# EAGLE design Open-GCI (EAGLE 9.4.2)
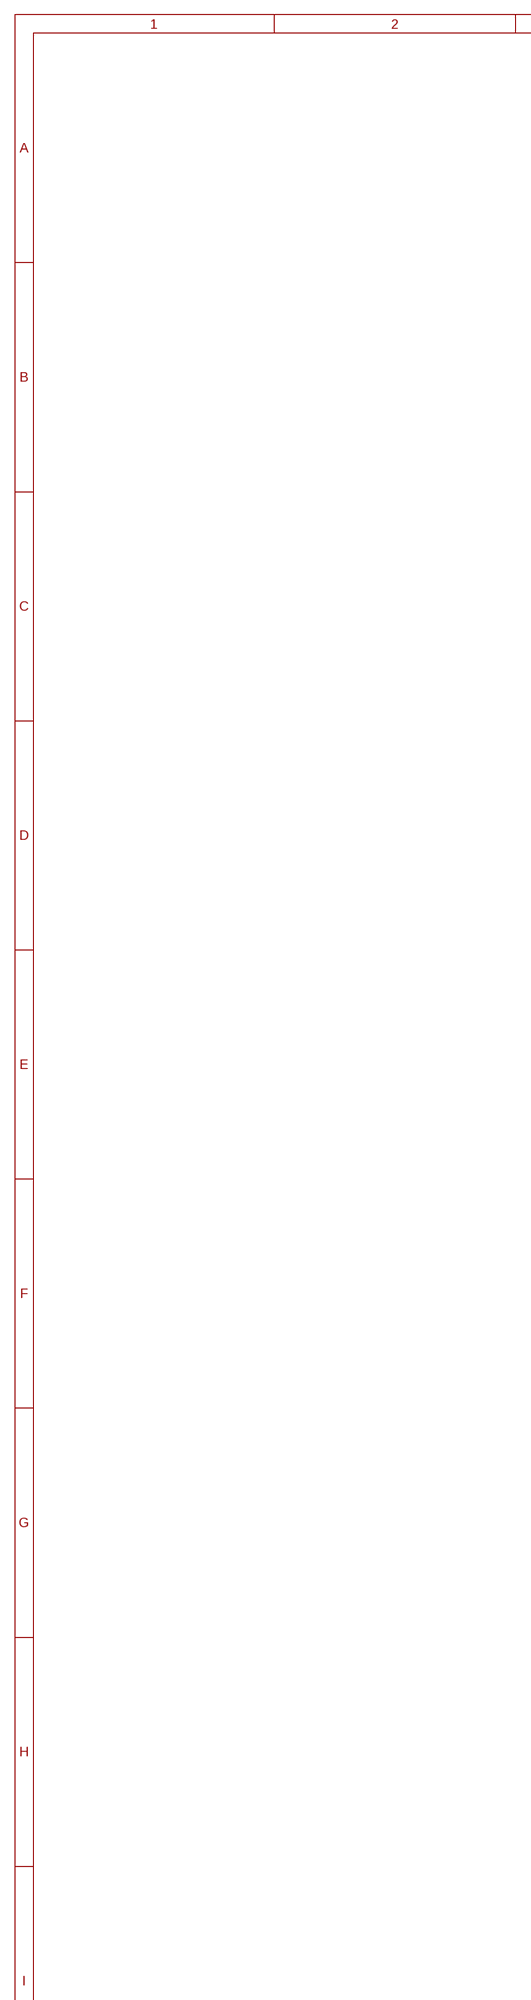
[diagram p0: schematic, sheet 1, part 1 of 2]
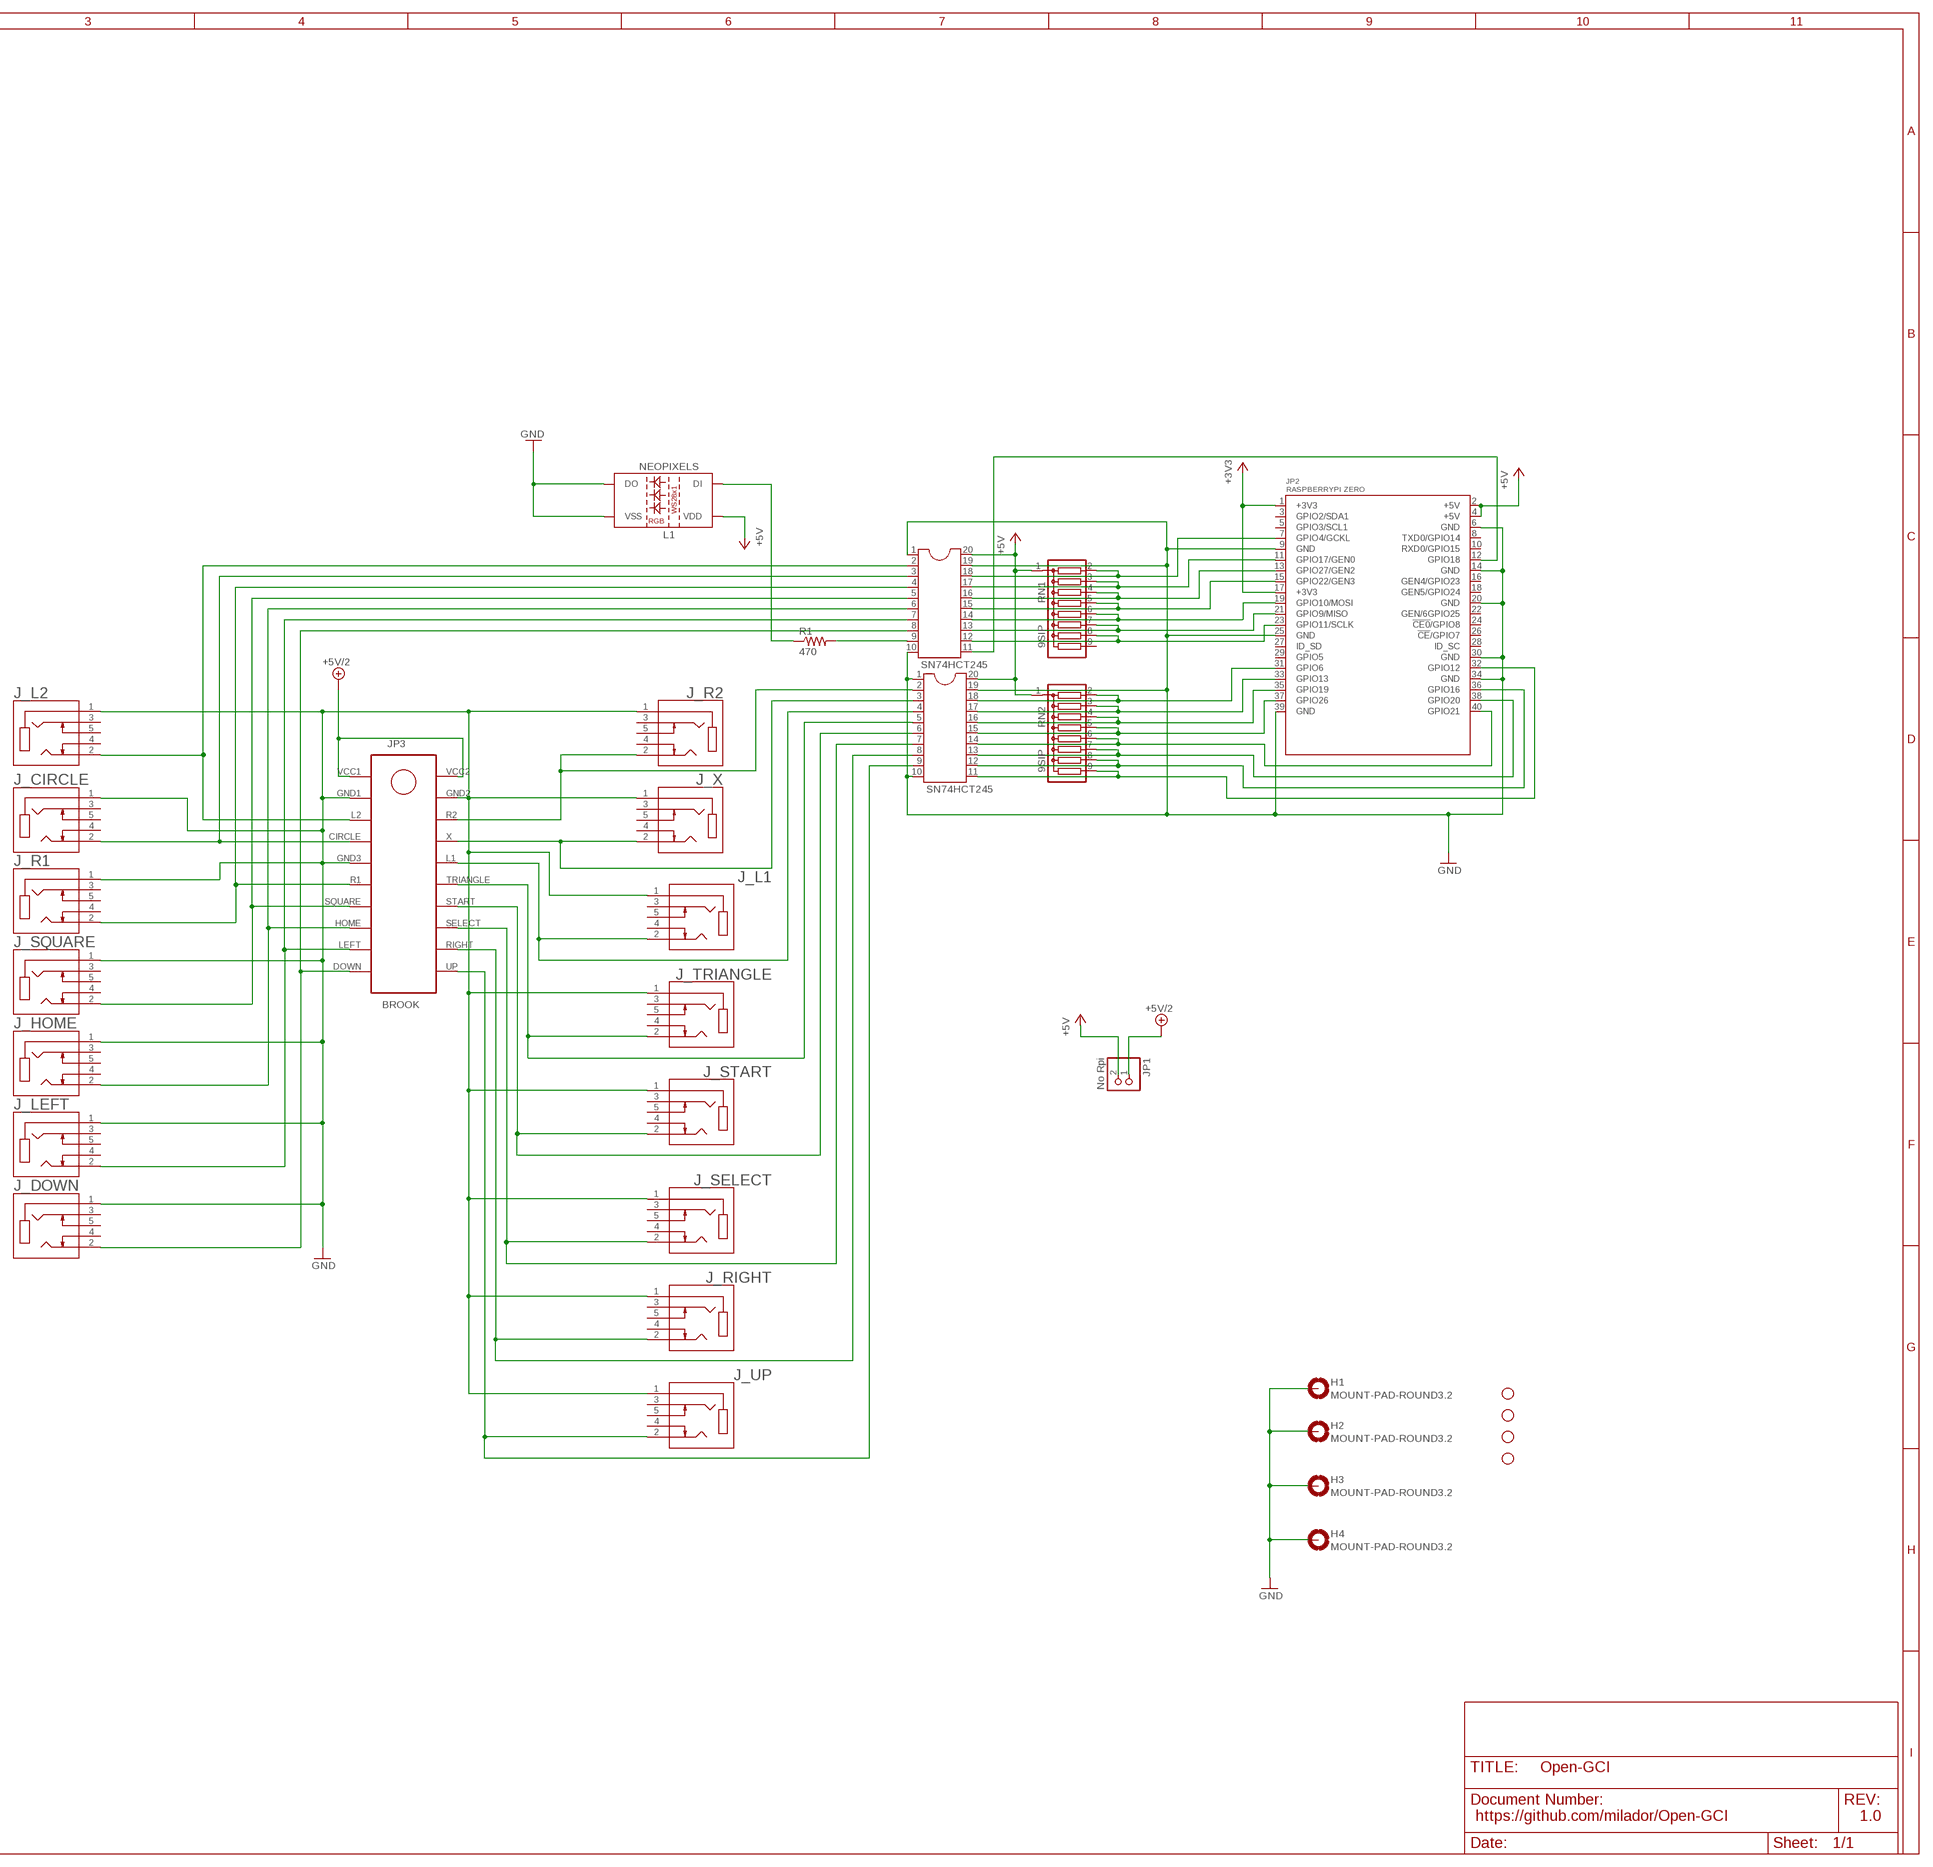
[diagram p1: schematic, sheet 1, part 2 of 2]

## Parts
H1  MOUNT-PAD-ROUND3.2  [3,2-PAD]
H2  MOUNT-PAD-ROUND3.2  [3,2-PAD]
H3  MOUNT-PAD-ROUND3.2  [3,2-PAD]
H4  MOUNT-PAD-ROUND3.2  [3,2-PAD]
H5  STAND-OFF  [STAND-OFF]
H6  STAND-OFF  [STAND-OFF]
H7  STAND-OFF  [STAND-OFF]
H8  STAND-OFF  [STAND-OFF]
IC1  SN74HCT245  74HCT245N  [SN74HCT245]
IC2  SN74HCT245  74HCT245N  [SN74HCT245]
J_CIRCLE  SJ1-3535NG  [CUI_SJ1-3535NG]
J_DOWN  SJ1-3535NG  [CUI_SJ1-3535NG]
J_HOME  SJ1-3535NG  [CUI_SJ1-3535NG]
J_L1  SJ1-3535NG  [CUI_SJ1-3535NG]
J_L2  SJ1-3535NG  [CUI_SJ1-3535NG]
J_LEFT  SJ1-3535NG  [CUI_SJ1-3535NG]
J_R1  SJ1-3535NG  [CUI_SJ1-3535NG]
J_R2  SJ1-3535NG  [CUI_SJ1-3535NG]
J_RIGHT  SJ1-3535NG  [CUI_SJ1-3535NG]
J_SELECT  SJ1-3535NG  [CUI_SJ1-3535NG]
J_SQUARE  SJ1-3535NG  [CUI_SJ1-3535NG]
J_START  SJ1-3535NG  [CUI_SJ1-3535NG]
J_TRIANGLE  SJ1-3535NG  [CUI_SJ1-3535NG]
J_UP  SJ1-3535NG  [CUI_SJ1-3535NG]
J_X  SJ1-3535NG  [CUI_SJ1-3535NG]
JP1  No Rpi  PINHD-1X2  [1X02]
JP2  RASPBERRYPI ZERO  RASPBERRYPI_ZERO  [RASPBERRYPI_ZERO]
JP3  BROOK  BROOK_2X10_FEMALE  [CONN_2X10]
L1  NEOPIXELS  NEOPIXELS-5MM  [NEOPIXELS-5MM]
R1  470  R-US_0204/7  [0204/7]
RN1  9SIP  SIL9  [SIL9]
RN2  9SIP  SIL9  [SIL9]

## Nets
+3V3: JP2.1(+3V3) JP2.17(+3V3)
+5V: IC1.20 IC2.20 JP1.2 JP2.2(+5V) JP2.4(+5V) L1.2(VDD) RN1.1 RN2.1
+5V/2: JP1.1 JP3.VCC1 JP3.VCC2
GND: H1.B3,2(MOUNT) H2.B3,2(MOUNT) H3.B3,2(MOUNT) H4.B3,2(MOUNT) IC1.1 IC1.10 IC1.19 IC2.1 IC2.10 IC2.19 J_CIRCLE.1 J_DOWN.1 J_HOME.1 J_L1.1 J_L2.1 J_LEFT.1 J_R1.1 J_R2.1 J_RIGHT.1 J_SELECT.1 J_SQUARE.1 J_START.1 J_TRIANGLE.1 J_UP.1 J_X.1 JP2.6(GND) JP2.9(GND) JP2.14(GND) JP2.20(GND) JP2.25(GND) JP2.30(GND) JP2.34(GND) JP2.39(GND) JP3.GND1 JP3.GND2 JP3.GND3 L1.3(VSS) L1.4(DO)
N$32: IC1.9 R1.2
N$33: L1.1(DI) R1.1
NGP7: IC1.18 JP2.7(GPIO4/GCKL) RN1.2
NGP11: IC1.17 JP2.11(GPIO17/GEN0) RN1.3
NGP12: IC1.11 JP2.12(GPIO18)
NGP13: IC1.16 JP2.13(GPIO27/GEN2) RN1.4
NGP15: IC1.15 JP2.15(GPIO22/GEN3) RN1.5
NGP19: IC1.14 JP2.19(GPIO10/MOSI) RN1.6
NGP21: IC1.13 JP2.21(GPIO9/MISO) RN1.7
NGP23: IC1.12 JP2.23(GPIO11/SCLK) RN1.8
NGP31: IC2.18 JP2.31(GPIO6) RN2.2
NGP32: IC2.11 JP2.32(GPIO12) RN2.9
NGP33: IC2.17 JP2.33(GPIO13) RN2.3
NGP35: IC2.16 JP2.35(GPIO19) RN2.4
NGP36: IC2.12 JP2.36(GPIO16) RN2.8
NGP37: IC2.15 JP2.37(GPIO26) RN2.5
NGP38: IC2.13 JP2.38(GPIO20) RN2.7
NGP40: IC2.14 JP2.40(GPIO21) RN2.6
NJ_CIR: IC1.3 J_CIRCLE.2 JP3.CIRCLE
NJ_DOWN: IC1.8 J_DOWN.2 JP3.DOWN
NJ_HOME: IC1.6 J_HOME.2 JP3.HOME
NJ_L1: IC2.4 J_L1.2 JP3.L1
NJ_L2: IC1.2 J_L2.2 JP3.L2
NJ_LEFT: IC1.7 J_LEFT.2 JP3.LEFT
NJ_R1: IC1.4 J_R1.2 JP3.R1
NJ_R2: IC2.2 J_R2.2 JP3.R2
NJ_RIGHT: IC2.8 J_RIGHT.2 JP3.RIGHT
NJ_SELECT: IC2.7 J_SELECT.2 JP3.SELECT
NJ_SQU: IC1.5 J_SQUARE.2 JP3.SQUARE
NJ_START: IC2.6 J_START.2 JP3.START
NJ_TRI: IC2.5 J_TRIANGLE.2 JP3.TRIANGLE
NJ_UP: IC2.9 J_UP.2 JP3.UP
NJ_X: IC2.3 J_X.2 JP3.X
Unconnected: J_CIRCLE.3 J_CIRCLE.4 J_CIRCLE.5 J_DOWN.3 J_DOWN.4 J_DOWN.5 J_HOME.3 J_HOME.4 J_HOME.5 J_L1.3 J_L1.4 J_L1.5 J_L2.3 J_L2.4 J_L2.5 J_LEFT.3 J_LEFT.4 J_LEFT.5 J_R1.3 J_R1.4 J_R1.5 J_R2.3 J_R2.4 J_R2.5 J_RIGHT.3 J_RIGHT.4 J_RIGHT.5 J_SELECT.3 J_SELECT.4 J_SELECT.5 J_SQUARE.3 J_SQUARE.4 J_SQUARE.5 J_START.3 J_START.4 J_START.5 J_TRIANGLE.3 J_TRIANGLE.4 J_TRIANGLE.5 J_UP.3 J_UP.4 J_UP.5 J_X.3 J_X.4 J_X.5 JP2.3(GPIO2/SDA1) JP2.5(GPIO3/SCL1) JP2.8(TXD0/GPIO14) JP2.10(RXD0/GPIO15) JP2.16(GEN4/GPIO23) JP2.18(GEN5/GPIO24) JP2.22(GEN/6GPIO25) JP2.24(!CE0!/GPIO8) JP2.26(!CE!/GPIO7) JP2.27(ID_SD) JP2.28(ID_SC) JP2.29(GPIO5) RN1.9

## Notes on the sheet
- https://github.com/milador/Open-GCI | 1.0

## Library data of the parts
H1-H4 = holes:MOUNT-PAD-ROUND: MOUNTING PAD, round
H5-H8 = SparkFun-Hardware:STAND-OFF: Stand Off Drill holes for mechanically mounting via screws, standoffs, etc. Note: Use the keepout ring to avoid running the screw head into surrounding components. Variant Overviews STAND-OFF - Mechanical footprint for a #4 phillips button head screw. STAND-OFF-TIGHT - Mechanical footprint for a #4 phillips button head screw, Example SparkFun Products Screw - Phillips Head (1/4", 4-40, 10 pack) <https://www.sparkfun.com/products/10453> (PRT-10453) Screw - Phillips Head (1/2", 4-40, 10 pack) <https://www.sparkfun.com/products/10452> (PRT-10452) Screw - Phillips Head (3/4", 4-40, 10 pack) <https://www.sparkfun.com/products/10451> (PRT-10451) Screw - Phillips Head (1", 4-40, 10 pack) <https://www.sparkfun.com/products/10450> (PRT-10450)
IC1 IC2 = milador:74HCT245
J_CIRCLE J_DOWN J_HOME J_L1 J_L2 J_LEFT J_R1 J_R2 J_RIGHT J_SELECT J_SQUARE J_START J_TRIANGLE J_UP J_X = milador:SJ1-3535NG: SJ1 Series 3.5 mm 12 V Right Angle Through Hole Isolated Stereo Audio Jack; MANUFACTURER: CUI; PARTREV: 1.02; STANDARD: Manufacturer recommendation
JP1 = pinhead:PINHD-1X2: PIN HEADER
JP2 = milador:RASPBERRYPI_ZERO
JP3 = milador:BROOK_2X10_FEMALE
L1 = milador:NEOPIXELS-5MM: WS2812B PTH addressable RGB LED 5mm PTH LED with built-in controller IC. Color: Red/Green/Blue mC Rating: RGB: 390, 660, 180 mcd Forward Voltage: RGB: 2.0, 3.0, 3.0 V SparkFun Products: LED - RGB Addressable, PTH, 5mm Diffused (5 Pack) <https://www.sparkfun.com/products/12986> LED - RGB Addressable, PTH, 5mm Clear (5 Pack) <https://www.sparkfun.com/products/12999> Datasheet referenced for footprint: WS2812B-PTH <https://cdn.sparkfun.com/datasheets/Components/LED/COM-12877.pdf>
R1 = milador:R-US_0204/7
RN1 RN2 = milador:SIL9

## Board
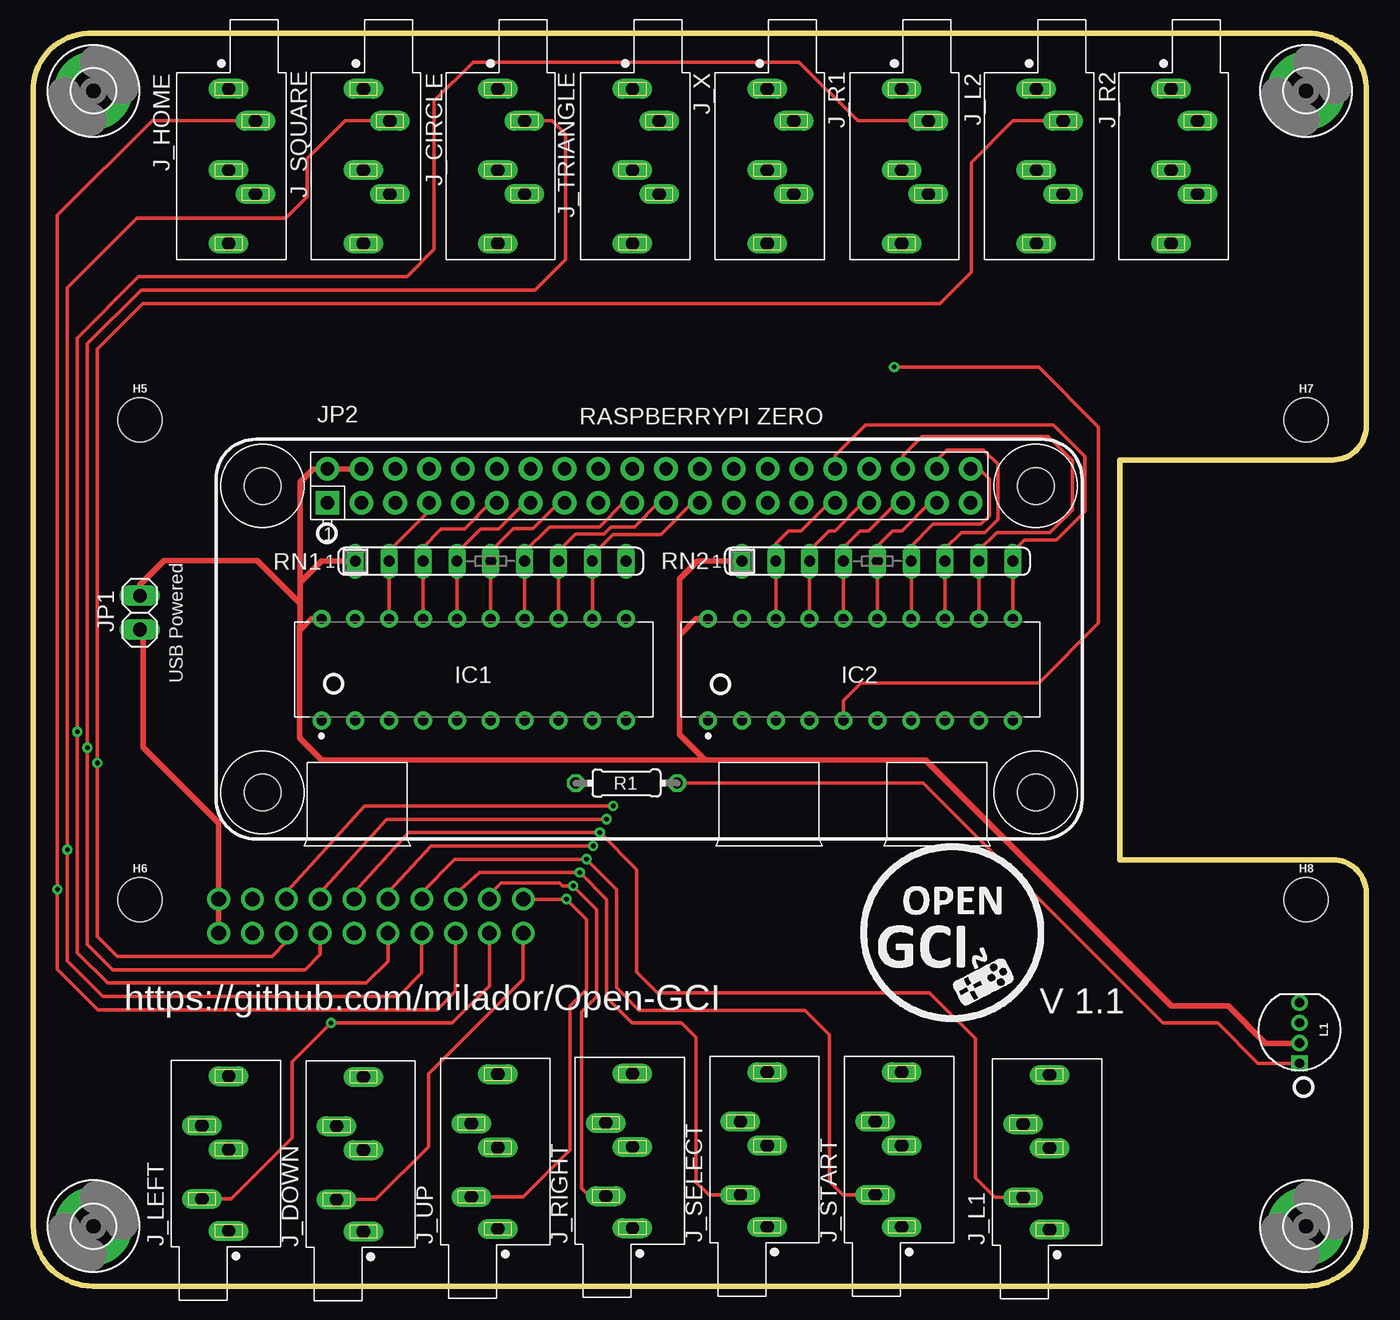
[diagram p2: board, top side]
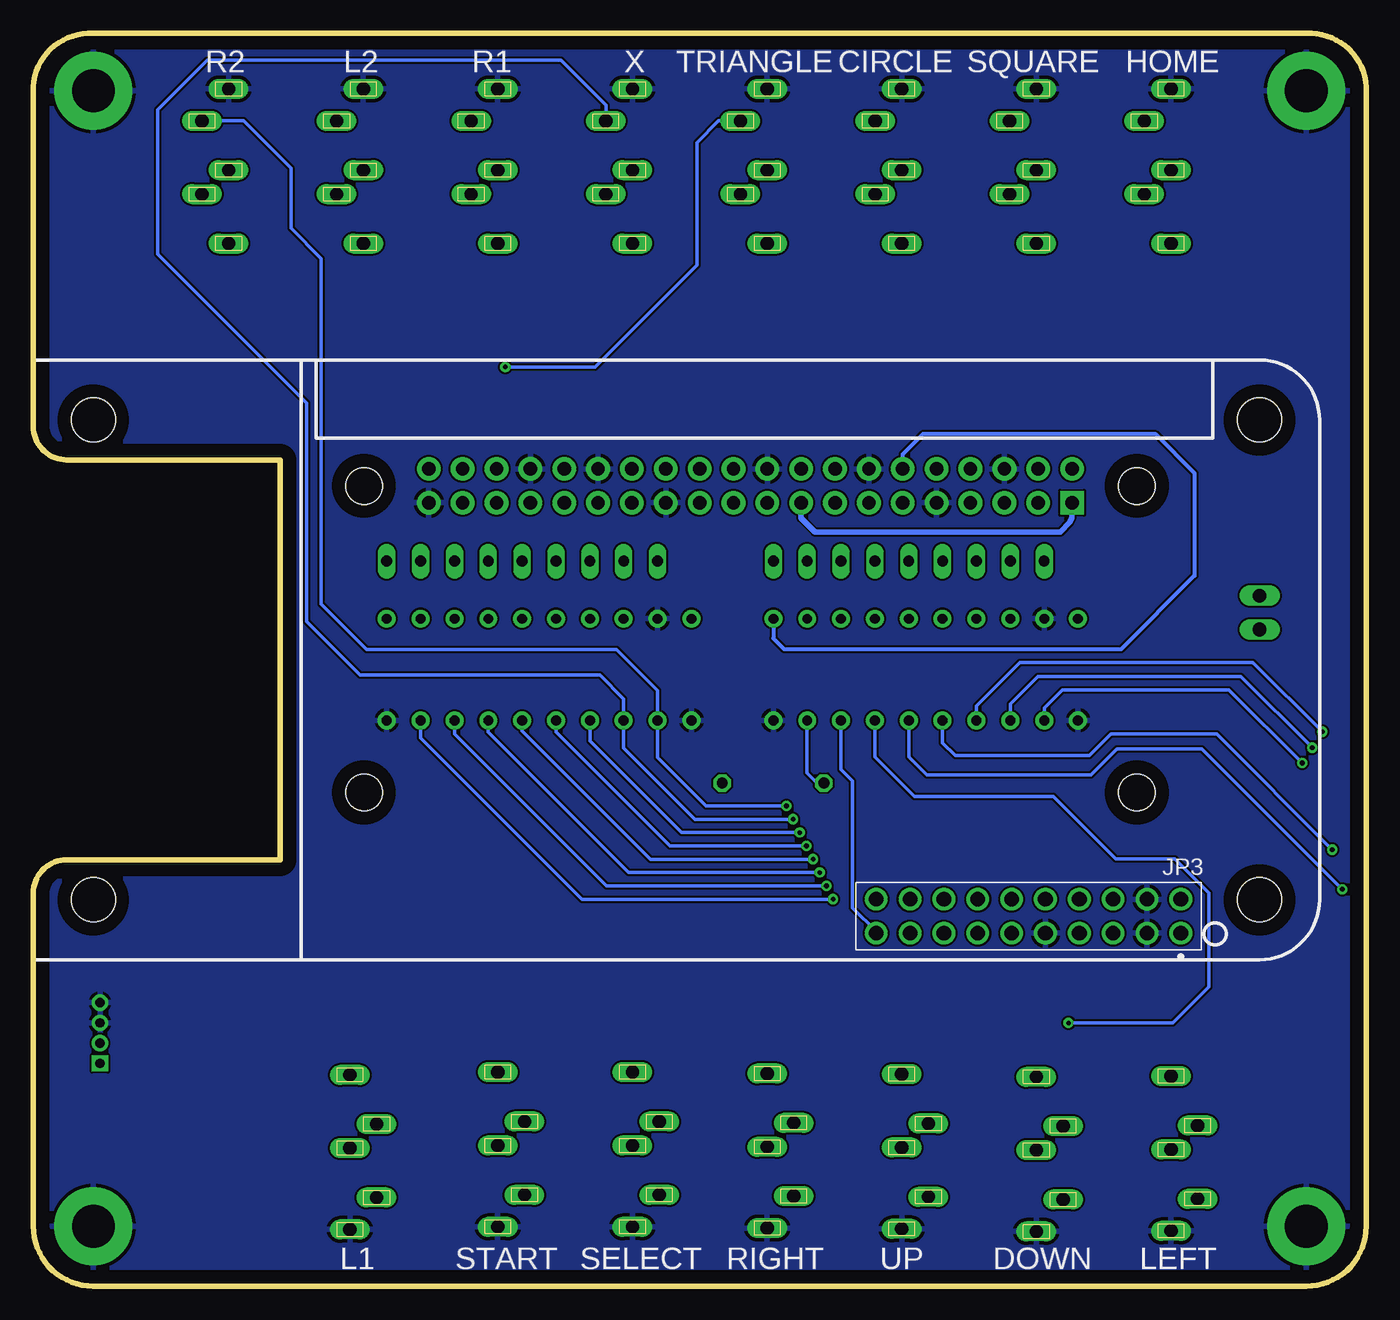
[diagram p3: board, bottom side, seen from below]

Size 100 x 94 mm. Coordinates in mm from the lower left corner, seen from the top.
Outline: 0,90 arc-90 4.5,94 95.5,94 arc-90 100,90 100,64.5 arc-90 97.5,62 81.5,62 81.5,32 97.5,32 arc-90 100,29.5 100,4.5 arc-90 95.5,0 4.5,0 arc-90 0,4.5 0,90
Copper layers (1*16): Top 0.035mm / dielectric 1.5mm / Bottom 0.035mm
Design rules "default": minimum track width 6mil, minimum drill 0.35mm, track to track 6mil, track to pad 6mil, pad to pad 6mil, via to via 6mil, smd to smd 6mil, copper to edge 40mil, drill to drill 6mil, minimum pad ring 10mil, minimum via ring 8mil, stop-mask expansion 4mil, vias tented up to drill 0mil, thermal gap 10mil

### Footprints (pad centres in the part's own frame; a part is rotated, then mirrored left to right if it is on the bottom)
3,2-PAD = drill 3.2 pad 5.842: B3,2 0,0
STAND-OFF = hole 3.302: 0,0
SN74HCT245 = drill 0.743 pad 1.343: 1 -3.81,11.43; 2 -3.81,8.89; 3 -3.81,6.35; 4 -3.81,3.81; 5 -3.81,1.27; 6 -3.81,-1.27; 7 -3.81,-3.81; 8 -3.81,-6.35; 9 -3.81,-8.89; 10 -3.81,-11.43; 11 3.81,-11.43; 12 3.81,-8.89; 13 3.81,-6.35; 14 3.81,-3.81; 15 3.81,-1.27; 16 3.81,1.27; 17 3.81,3.81; 18 3.81,6.35; 19 3.81,8.89; 20 3.81,11.43
CUI_SJ1-3535NG = drill 1 long: 1 0,0; 2 2.4,2; 3 7.9,2; 4 11.6,0; 5 6.1,0
1X02 = drill 1.016 long: 1 -1.27,0; 2 1.27,0
RASPBERRYPI_ZERO = drill 1 pad 1.778 square: 1 8.37,25.23 | drill 1 pad 1.778: 2 8.37,27.77; 3 10.91,25.23; 4 10.91,27.77; 5 13.45,25.23; 6 13.45,27.77; 7 15.99,25.23; 8 15.99,27.77; 9 18.53,25.23; 10 18.53,27.77; 11 21.07,25.23; 12 21.07,27.77; 13 23.61,25.23; 14 23.61,27.77; 15 26.15,25.23; 16 26.15,27.77; 17 28.69,25.23; 18 28.69,27.77; 19 31.23,25.23; 20 31.23,27.77; 21 33.77,25.23; 22 33.77,27.77; 23 36.31,25.23; 24 36.31,27.77; 25 38.85,25.23; 26 38.85,27.77; 27 41.39,25.23; 28 41.39,27.77; 29 43.93,25.23; 30 43.93,27.77; 31 46.47,25.23; 32 46.47,27.77; 33 49.01,25.23; 34 49.01,27.77; 35 51.55,25.23; 36 51.55,27.77; 37 54.09,25.23; 38 54.09,27.77; 39 56.63,25.23; 40 56.63,27.77 | hole 2.75: 3.5,3.5; 3.5,26.5; 61.5,3.5; 61.5,26.5
CONN_2X10 = drill 1.105 pad 1.705: CIRCLE 7.62,0; DOWN 22.86,0; GND1 2.54,0; GND2 2.54,-2.54; GND3 10.16,0; HOME 17.78,0; L1 10.16,-2.54; L2 5.08,0; LEFT 20.32,0; R1 12.7,0; R2 5.08,-2.54; RIGHT 20.32,-2.54; SELECT 17.78,-2.54; SQUARE 15.24,0; START 15.24,-2.54; TRIANGLE 12.7,-2.54; UP 22.86,-2.54; VCC1 0,0; VCC2 0,-2.54; X 7.62,-2.54
NEOPIXELS-5MM = drill 0.7 pad 1.016 square: 1 2.28,0 | drill 0.7 pad 1.016: 2 0.76,0; 3 -0.76,0; 4 -2.28,0
0204/7 = drill 0.813 octagon: 1 -3.81,0; 2 3.81,0
SIL9 = drill 0.813 long: 1 -10.16,0; 2 -7.62,0; 3 -5.08,0; 4 -2.54,0; 5 0,0; 6 2.54,0; 7 5.08,0; 8 7.62,0; 9 10.16,0

### Placement (x,y rotation side)
H1  4.5,89.69 0 top
H2  95.5,89.69 0 top
H3  95.5,4.5 0 top
H4  4.5,4.5 0 top
H5  8,65 0 top
H6  8,29 0 top
H7  95.5,65 0 top
H8  95.5,29 0 top
IC1  33.05,46.27 90 top
IC2  62.06,46.27 90 top
J_CIRCLE  34.85,89.84 270 top
J_DOWN  24.75,4.11 90 top
J_HOME  14.65,89.84 270 top
J_L1  76.25,4.26 90 top
J_L2  75.25,89.84 270 top
J_LEFT  14.65,4.16 90 top
J_R1  65.15,89.84 270 top
J_R2  85.35,89.84 270 top
J_RIGHT  44.95,4.36 90 top
J_SELECT  55.05,4.46 90 top
J_SQUARE  24.75,89.84 270 top
J_START  65.15,4.46 90 top
J_TRIANGLE  44.95,89.84 270 top
J_UP  34.85,4.31 90 top
J_X  55.05,89.84 270 top
JP1  7.99,50.54 90 top
JP2  13.7,33.55 0 top
JP3  13.9,26.5 180 bottom
L1  95,19 270 top
R1  44.5,37.75 180 top
RN1  34.32,54.4 0 top
RN2  63.33,54.4 0 top

### Tracks (layer width: path | path; a pad name or v marks a point on that pad's centre or on a via)
+3V3
  Bottom 0.406: JP2.1 22.07,57.67 22.22,57.33 22.95,56.59 41.35,56.59 42.39,57.63 JP2.17
+5V
  Top 0.406: JP2.4 JP2.2 20.99,61.32 20.01,60.35 20.01,52.78 | RN2.1 49.81,54.4 48.47,53.05 48.47,49.05 48.58,48.94 | IC2.20 49.73,50.08 48.58,48.94 | 48.58,48.94 48.48,48.84 48.48,41.39 50.4,39.48 | JP1.2 7.99,52.61 9.8,54.43 16.8,54.43 20.01,51.22 | 20.01,51.22 20.01,49.53 | 20.01,49.53 20.01,49.21 20.88,50.08 IC1.20 | 20.01,52.78 20.01,51.22 | RN1.1 21.63,54.4 20.01,52.78 | L1.2 92.44,18.24 89.65,21.03 85.37,21.03 66.92,39.48 50.4,39.48 | 20.01,49.53 19.96,49.49 19.96,41.15 21.64,39.48 50.4,39.48
+5V/2
  Top 0.406: JP1.1 8.26,49 8.26,40.42 13.9,34.78 JP3.VCC2 JP3.VCC1
GND
  pour Bottom: 100,89.69 100,4.5 arc-90 95.5,0 4.5,0 arc-90 0,4.5 0,90 arc-90 4.5,94 95.5,94 arc-90
N$32
  Bottom 0.254: IC1.9 41.94,38.5 41.19,37.75 R1.2
N$33
  Top 0.254: L1.1 91.89,16.72 88.85,19.75 84.74,19.75 66.74,37.75 R1.1
NGP7
  Top 0.254: JP2.7 29.69,58.15 26.69,55.15 26.69,54.41 RN1.2 IC1.18
NGP11
  Top 0.254: JP2.11 34.32,58.78 32.34,56.81 30.6,56.81 29.24,55.44 RN1.3 IC1.17
NGP12
  Bottom 0.305: IC1.11 44.48,48.6 43.68,47.8 18.38,47.8 12.88,53.3 12.88,61.01 15.83,63.95 33.23,63.95 34.78,62.41 34.78,61.33 JP2.12
NGP13
  Top 0.254: JP2.13 36.89,58.78 34.92,56.82 33.55,56.82 31.78,55.05 RN1.4 IC1.16
NGP15
  Top 0.254: JP2.15 39.44,58.78 37.49,56.83 36.04,56.83 34.32,55.11 RN1.5 IC1.15
NGP19
  Top 0.254: JP2.19 44.29,58.78 42.48,56.97 38.72,56.97 36.86,55.11 RN1.6 IC1.14
NGP21
  Top 0.254: JP2.21 46.91,58.78 45.09,56.97 43.34,56.97 42.82,56.45 40.67,56.45 39.4,55.17 RN1.7 IC1.13
NGP23
  Top 0.254: JP2.23 49.46,58.78 47.08,56.4 43.49,56.4 41.94,54.84 RN1.8 IC1.12
NGP31
  Top 0.254: IC2.18 RN2.2 55.7,55.72 56.64,56.65 57.6,56.65 59.73,58.78 JP2.31 | IC2.18
NGP32
  Top 0.254: IC2.11 RN2.9 73.48,55.1 74.36,55.97 76.74,55.97 78.89,58.12 78.89,62.27 76.54,64.62 62.43,64.62 60.17,62.36 JP2.32 | IC2.11
NGP33
  Top 0.254: IC2.17 RN2.3 58.24,55.21 59.69,56.65 60.13,56.65 62.26,58.78 JP2.33 | IC2.17
NGP35
  Top 0.254: IC2.16 RN2.4 60.78,55.43 62.01,56.65 62.65,56.65 64.78,58.78 JP2.35 | IC2.16
NGP36
  Top 0.254: IC2.12 RN2.8 70.94,55.22 72.28,56.56 76.26,56.56 77.95,58.25 77.95,61.95 76.15,63.74 66.68,63.74 65.25,62.31 JP2.36 | IC2.12
NGP37
  Top 0.254: IC2.15 RN2.5 63.33,55.54 64.45,56.67 65.16,56.67 67.28,58.78 JP2.37 | IC2.15
NGP38
  Top 0.254: IC2.13 RN2.7 68.41,55.34 69.62,56.55 71.4,56.55 72.36,57.52 72.36,61.67 71.29,62.74 68.55,62.74 67.79,61.98 JP2.38 | IC2.13
NGP40
  Top 0.254: IC2.14 RN2.6 65.86,55.53 67.51,57.17 71.09,57.17 71.71,57.8 71.71,60.58 70.97,61.32 JP2.40 | IC2.14
NJ_CIR  (via drill 0.35)
  Top 0.254: J_CIRCLE.2 38.91,87.44 39.92,86.44 39.92,77.03 37.62,74.74 8.07,74.74 4.05,70.72 v4.05,40.41 4.05,25.64 5.94,23.75 20.39,23.75 21.52,24.88 JP3.CIRCLE
  Bottom 0.254: IC1.3 26.7,43.69 24.63,45.76 9.4,45.76 v4.05,40.41
NJ_DOWN
  Top 0.254: J_DOWN.2 25.69,6.51 29.66,10.47 29.66,15.93 36.76,23.04 JP3.DOWN
  Bottom 0.254: IC1.8 39.4,38.76 38.55,37.92 38.55,28.4 36.76,26.61 JP3.DOWN
NJ_HOME  (via drill 0.35)
  Top 0.254: J_HOME.2 8.92,87.44 1.8,80.35 v1.8,29.78 1.8,23.78 4.83,20.75 30.28,20.75 31.68,22.15 JP3.HOME
  Bottom 0.254: IC1.6 34.32,39.73 32.96,38.36 20.66,38.36 18.73,40.3 12.32,40.3 v1.8,29.78
NJ_L1  (via drill 0.35)
  Top 0.254: J_L1.2 72.13,6.66 70.67,8.12 70.67,18.61 67.25,22.03 46.82,22.03 45.25,23.6 45.25,31.29 v42.5,34.04 28.17,34.04 24.06,29.54 JP3.L1
  Bottom 0.254: IC2.4 58.24,40.92 51.37,34.04 v42.5,34.04
NJ_L2  (via drill 0.35)
  Top 0.254: J_L2.2 73.51,87.44 70.37,84.3 70.37,76.08 68.03,73.74 8.22,73.74 4.8,70.32 v4.8,39.26 4.8,26.24 6.29,24.75 17.9,24.75 18.98,25.83 JP3.L2
  Bottom 0.254: IC1.2 24.16,43.4 22.81,44.75 10.59,44.75 10.3,44.75 v4.8,39.26
NJ_LEFT  (via drill 0.35)
  Top 0.254: J_LEFT.2 14.83,6.56 19.41,11.14 19.41,16.84 v22.33,19.75 31.43,19.75 34.22,22.54 JP3.LEFT
  Bottom 0.254: IC1.7 36.86,39.71 33.9,36.75 23.48,36.75 18.79,32.05 14.34,32.05 11.81,29.51 11.81,22.44 14.5,19.75 v22.33,19.75
NJ_R1  (via drill 0.35)
  Top 0.254: J_R1.2 61.85,87.44 57.45,91.84 32.98,91.84 30.09,88.94 30.09,77.8 28.03,75.74 7.89,75.74 3.3,71.15 v3.3,41.6 3.3,25.02 5.57,22.75 24.98,22.75 26.6,24.37 JP3.R1
  Bottom 0.254: IC1.4 29.24,43.55 25.98,46.8 8.5,46.8 v3.3,41.6
NJ_R2  (via drill 0.35)
  Top 0.254: v43.5,36.04 24.87,36.04 18.98,29.54 JP3.R2
  Bottom 0.254: v43.5,36.04 49.54,36.04 53.16,39.67 IC2.2 53.16,44.7 56.26,47.79 75,47.79 78.4,51.19 78.4,77.11 80.67,79.39 80.67,83.88 84.23,87.44 J_R2.2
NJ_RIGHT  (via drill 0.35)
  Top 0.254: J_RIGHT.2 41.73,6.76 41.13,7.36 41.13,20.6 42.25,21.72 42.25,28.29 v40.5,30.04 39.71,30.04 39.49,30.26 35.1,30.26 34.22,29.38 JP3.RIGHT
  Bottom 0.254: IC2.8 68.41,41.43 57.01,30.04 v40.5,30.04
NJ_SELECT  (via drill 0.35)
  Top 0.254: J_SELECT.2 50.68,6.86 49.73,7.81 49.73,18.66 48.63,19.75 44.93,19.75 43,21.68 43,29.04 v41,31.04 33.5,31.04 31.68,29.43 JP3.SELECT
  Bottom 0.254: IC2.7 65.86,41.57 55.33,31.04 v41,31.04
NJ_SQU  (via drill 0.35)
  Top 0.254: J_SQUARE.2 23.39,87.44 20.55,84.59 20.55,81.75 18.95,80.15 7.76,80.15 2.55,74.94 v2.55,32.75 2.55,24.41 5.21,21.75 27.4,21.75 29.14,23.49 JP3.SQUARE
  Bottom 0.254: IC1.5 31.78,40.76 30.83,39.81 20.79,39.81 19.17,41.43 11.22,41.43 v2.55,32.75
NJ_START  (via drill 0.35)
  Top 0.254: J_START.2 60.73,6.86 59.73,7.86 59.73,18.86 57.88,20.7 45.46,20.7 43.75,22.41 43.75,29.79 v41.5,32.04 31.62,32.04 29.14,29.52 JP3.START
  Bottom 0.254: IC2.6 63.33,41.67 53.69,32.04 v41.5,32.04
NJ_TRI  (via drill 0.35)
  Top 0.254: v42,33.04 29.86,33.04 26.6,29.54 JP3.TRIANGLE | v64.59,68.97 75.43,68.97 79.92,64.47 79.92,49.75 75.42,45.25 62.08,45.25 60.78,43.95 IC2.5
  Bottom 0.254: IC2.5 60.78,41.58 52.24,33.04 v42,33.04 | J_TRIANGLE.2 48.58,87.44 50.22,85.8 50.22,76.61 57.86,68.97 v64.59,68.97
NJ_UP  (via drill 0.35)
  Top 0.254: J_UP.2 36.73,6.71 40.27,10.24 40.27,21.03 41.5,22.27 41.5,27.54 v40,29.04 JP3.UP
  Bottom 0.254: IC2.9 70.94,41.15 58.83,29.04 v40,29.04
NJ_X  (via drill 0.35)
  Top 0.254: v43,35.04 26.52,35.04 21.52,29.5 JP3.X
  Bottom 0.254: v43,35.04 50.35,35.04 55.7,40.39 IC2.3 55.7,44.06 57.5,45.85 75.47,45.85 79.5,49.88 79.5,66.27 90.67,77.44 90.67,88.26 86.96,91.97 60.41,91.97 57.05,88.62 J_X.2

### Text on the board
tNames: USB Powered | https://github.com/milador/Open-GCI | V 1.1
bNames: HOME | SQUARE | CIRCLE | TRIANGLE | X | R1 | L2 | R2 | LEFT | DOWN | UP | RIGHT | SELECT | START | L1